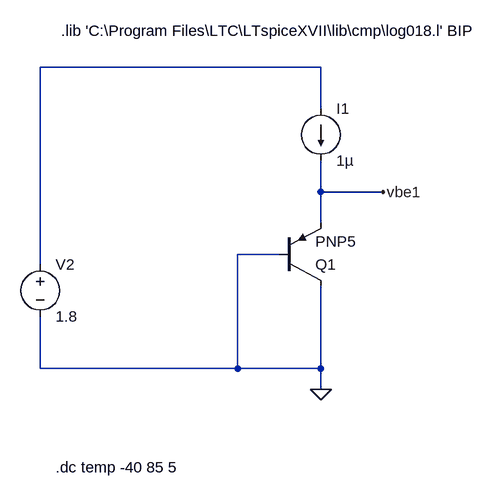
[diagram p0: schematic E1_BJT_CTAT.asc]
E1_BJT_CTAT.asc, the LTspice schematic file:
Version 4
SHEET 1 1892 752
WIRE 512 64 80 64
WIRE 512 128 512 64
WIRE 512 256 512 208
WIRE 608 256 512 256
WIRE 512 304 512 256
WIRE 448 352 384 352
WIRE 80 368 80 64
WIRE 80 528 80 448
WIRE 384 528 384 352
WIRE 384 528 80 528
WIRE 512 528 512 400
WIRE 512 528 384 528
WIRE 512 560 512 528
FLAG 512 560 0
FLAG 608 256 vbe1
SYMBOL voltage 80 352 R0
WINDOW 123 0 0 Left 0
WINDOW 39 0 0 Left 0
SYMATTR InstName V2
SYMATTR Value 1.8
SYMBOL pnp2 448 400 M180
SYMATTR InstName Q1
SYMATTR Value PNP5
SYMBOL current 512 128 R0
WINDOW 123 0 0 Left 0
WINDOW 39 0 0 Left 0
SYMATTR InstName I1
SYMATTR Value 1µ
TEXT 104 680 Left 2 !.dc temp -40 85 5
TEXT 112 8 Left 2 !.lib 'C:\\Program Files\\LTC\\LTspiceXVII\\lib\\cmp\\log018.l' BIP

The netlist it stands for:
* E1_BJT_CTAT.asc
V2 N001 0 1.8
Q1 0 0 vbe1 0 PNP5
I1 N001 vbe1 1µ
.model NPN NPN
.model PNP PNP
.lib standard.bjt
.dc temp -40 85 5
.lib 'C:\Program Files\LTC\LTspiceXVII\lib\cmp\log018.l' BIP
.backanno
.end